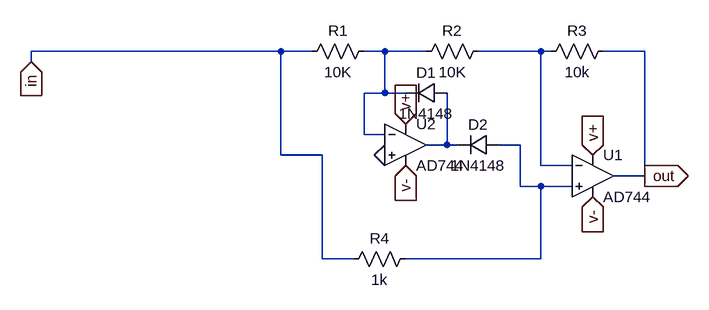
[diagram p0: schematic etj4.asc]
etj4.asc, the LTspice schematic file:
Version 4
SHEET 1 880 680
WIRE 128 -16 -256 -16
WIRE 176 -16 128 -16
WIRE 288 -16 256 -16
WIRE 352 -16 288 -16
WIRE 528 -16 432 -16
WIRE 544 -16 528 -16
WIRE 688 -16 624 -16
WIRE -256 0 -256 -16
WIRE 288 48 288 -16
WIRE 288 48 256 48
WIRE 320 48 288 48
WIRE 256 112 256 48
WIRE 288 112 256 112
WIRE 384 128 384 48
WIRE 384 128 352 128
WIRE 400 128 384 128
WIRE 496 128 464 128
WIRE 128 144 128 -16
WIRE 192 144 128 144
WIRE 528 160 528 -16
WIRE 576 160 528 160
WIRE 688 176 688 -16
WIRE 688 176 640 176
WIRE 496 192 496 128
WIRE 528 192 496 192
WIRE 576 192 528 192
WIRE 192 304 192 144
WIRE 240 304 192 304
WIRE 528 304 528 192
WIRE 528 304 320 304
FLAG 288 144 0
FLAG 320 96 v+
IOPIN 320 96 In
FLAG 608 144 v+
IOPIN 608 144 In
FLAG 320 160 v-
IOPIN 320 160 In
FLAG 608 208 v-
IOPIN 608 208 In
FLAG 688 176 out
IOPIN 688 176 Out
FLAG -256 0 in
IOPIN -256 0 In
SYMBOL res 272 -32 R90
WINDOW 0 0 56 VBottom 2
WINDOW 3 32 56 VTop 2
SYMATTR InstName R1
SYMATTR Value 10K
SYMBOL res 448 -32 R90
WINDOW 0 0 56 VBottom 2
WINDOW 3 32 56 VTop 2
SYMATTR InstName R2
SYMATTR Value 10K
SYMBOL res 640 -32 R90
WINDOW 0 0 56 VBottom 2
WINDOW 3 32 56 VTop 2
SYMATTR InstName R3
SYMATTR Value 10k
SYMBOL OpAmps\\AD744 608 112 R0
SYMATTR InstName U1
SYMBOL diode 384 32 R90
WINDOW 0 0 32 VBottom 2
WINDOW 3 32 32 VTop 2
SYMATTR InstName D1
SYMATTR Value 1N4148
SYMBOL diode 464 112 R90
WINDOW 0 0 32 VBottom 2
WINDOW 3 32 32 VTop 2
SYMATTR InstName D2
SYMATTR Value 1N4148
SYMBOL res 336 288 R90
WINDOW 0 0 56 VBottom 2
WINDOW 3 32 56 VTop 2
SYMATTR InstName R4
SYMATTR Value 1k
SYMBOL OpAmps\\AD744 320 64 R0
SYMATTR InstName U2

The netlist it stands for:
* etj4.asc
R1 N001 in 10K
R2 N002 N001 10K
R3 out N002 10k
XU1 N004 N002 v+ v- out AD744  ; pins In+ In- V+ V- OUT
D1 N003 N001 1N4148
D2 N004 N003 1N4148
R4 N004 in 1k
XU2 0 N001 v+ v- N003 AD744  ; pins In+ In- V+ V- OUT
.model D D
.lib standard.dio
.backanno
.end